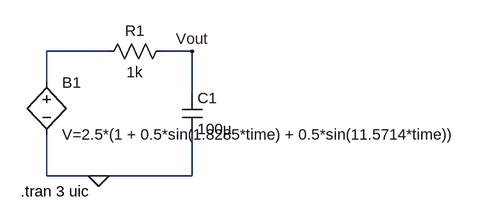
[diagram p0: schematic LTSpice_schematic_double_sine.asc]
LTSpice_schematic_double_sine.asc, the LTspice schematic file:
Version 4.1
SHEET 1 880 680
WIRE 176 64 80 64
WIRE 304 64 256 64
WIRE 80 112 80 64
WIRE 304 128 304 64
WIRE 80 256 80 192
WIRE 160 256 80 256
WIRE 304 256 304 192
WIRE 304 256 160 256
FLAG 160 256 0
FLAG 304 64 Vout
SYMBOL bv 80 96 R0
SYMATTR InstName B1
SYMATTR Value V=2.5*(1 + 0.5*sin(1.8285*time) + 0.5*sin(11.5714*time))
SYMBOL res 272 48 R90
WINDOW 0 0 56 VBottom 2
WINDOW 3 32 56 VTop 2
SYMATTR InstName R1
SYMATTR Value 1k
SYMBOL cap 288 128 R0
SYMATTR InstName C1
SYMATTR Value 100µ
TEXT 40 280 Left 2 !.tran 3 uic

The netlist it stands for:
* LTSpice_schematic_double_sine.asc
B1 N001 0 V=2.5*(1 + 0.5*sin(1.8285*time) + 0.5*sin(11.5714*time))
R1 Vout N001 1k
C1 Vout 0 100µ
.tran 3 uic
.backanno
.end